# Altium schematic sheet BMS.SchDoc
size A2; SheetNumber: 3; SheetTotal: 10
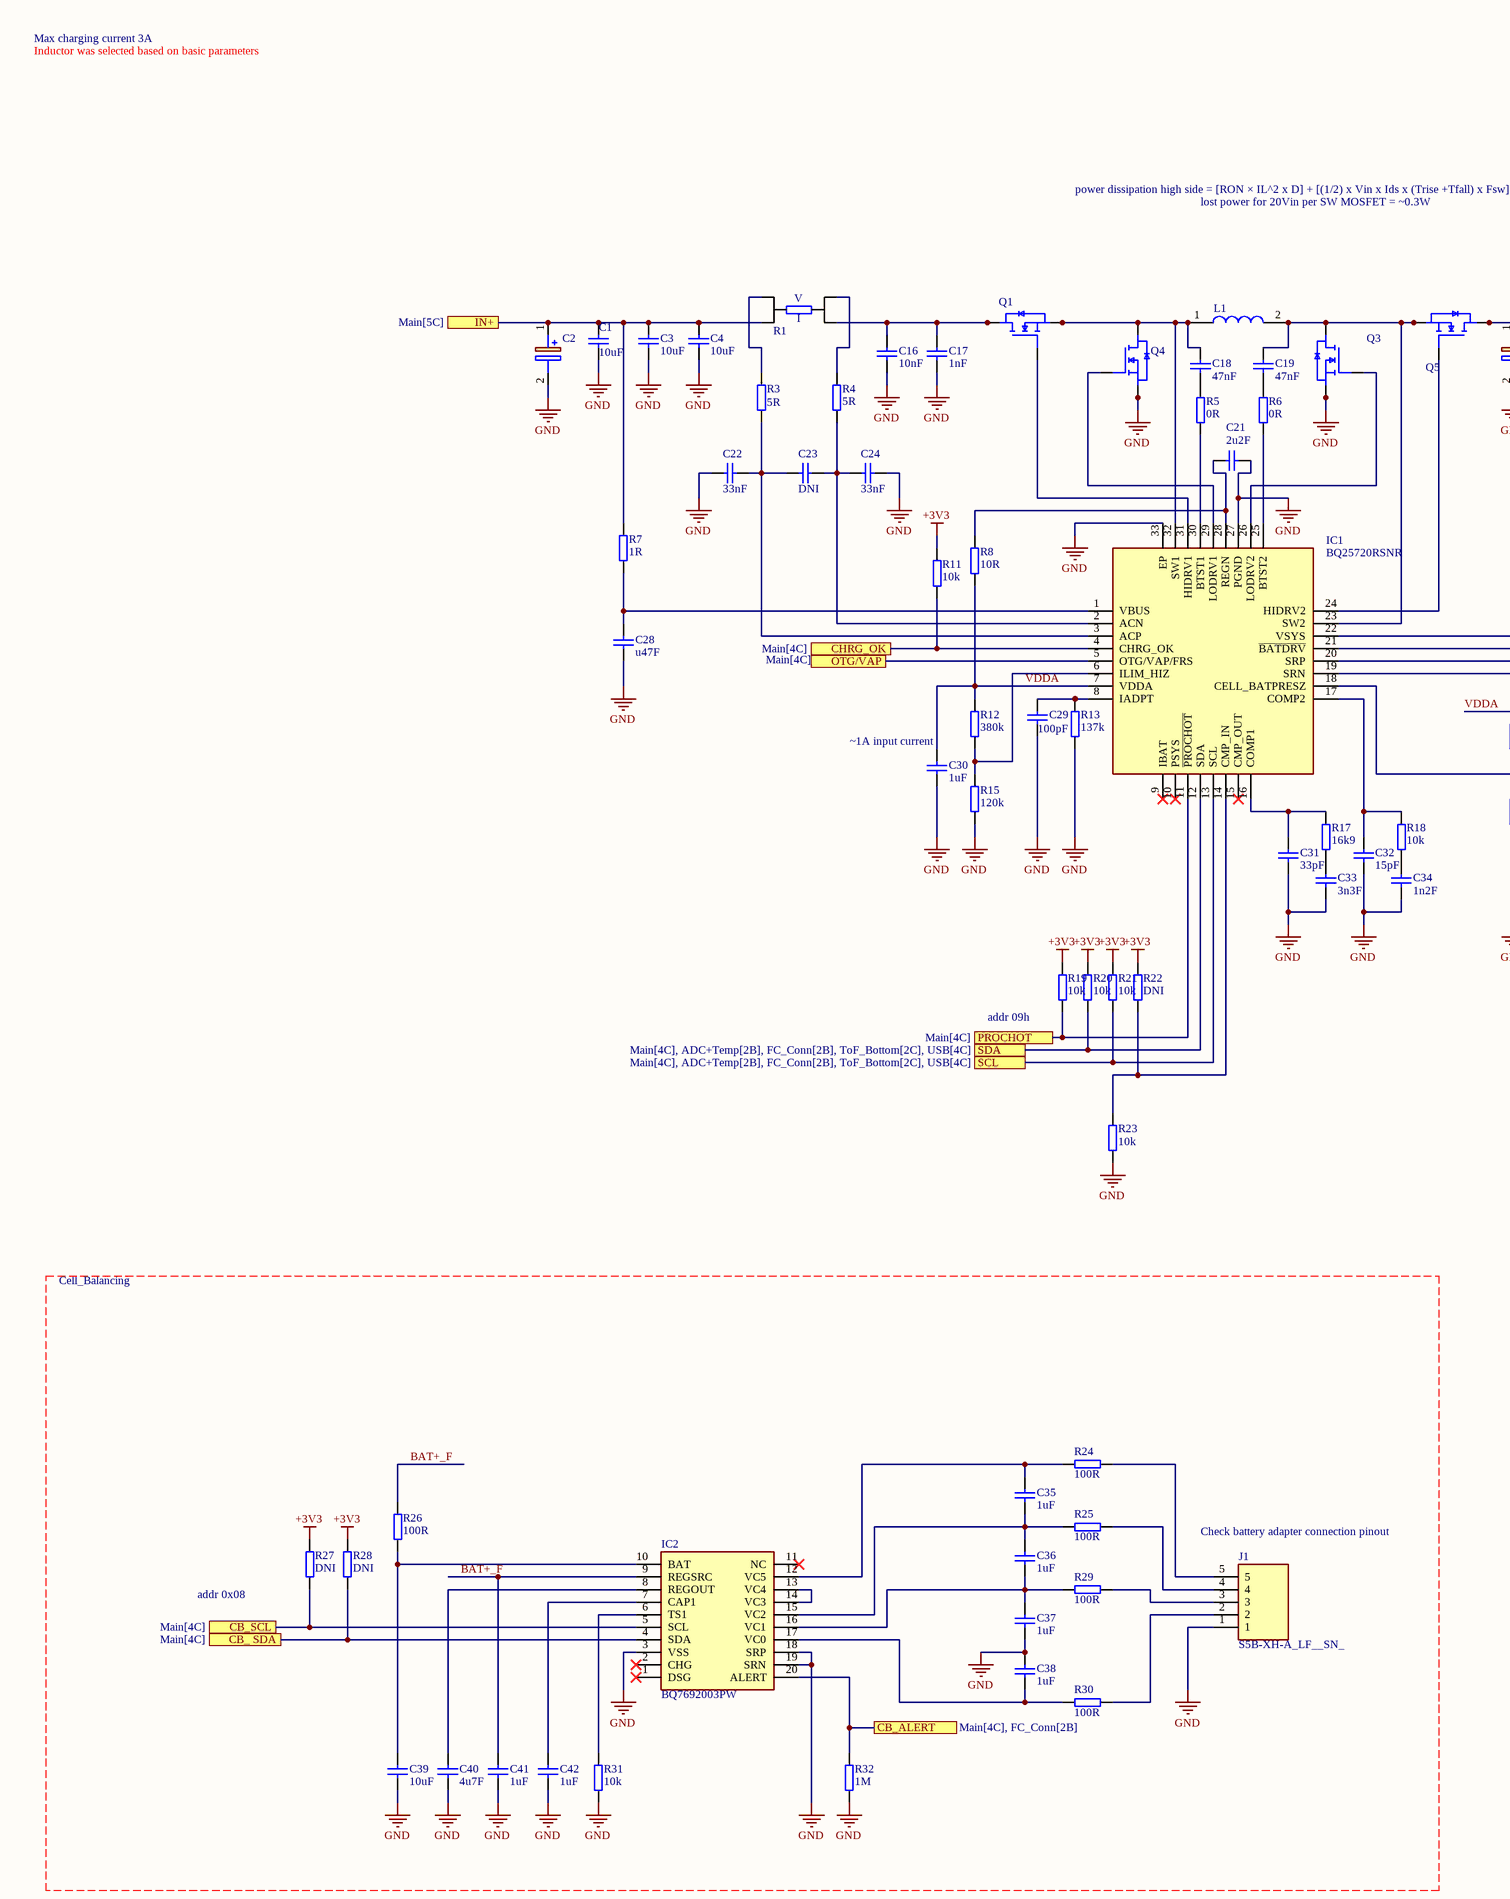
[diagram p0: BMS.SchDoc, left]
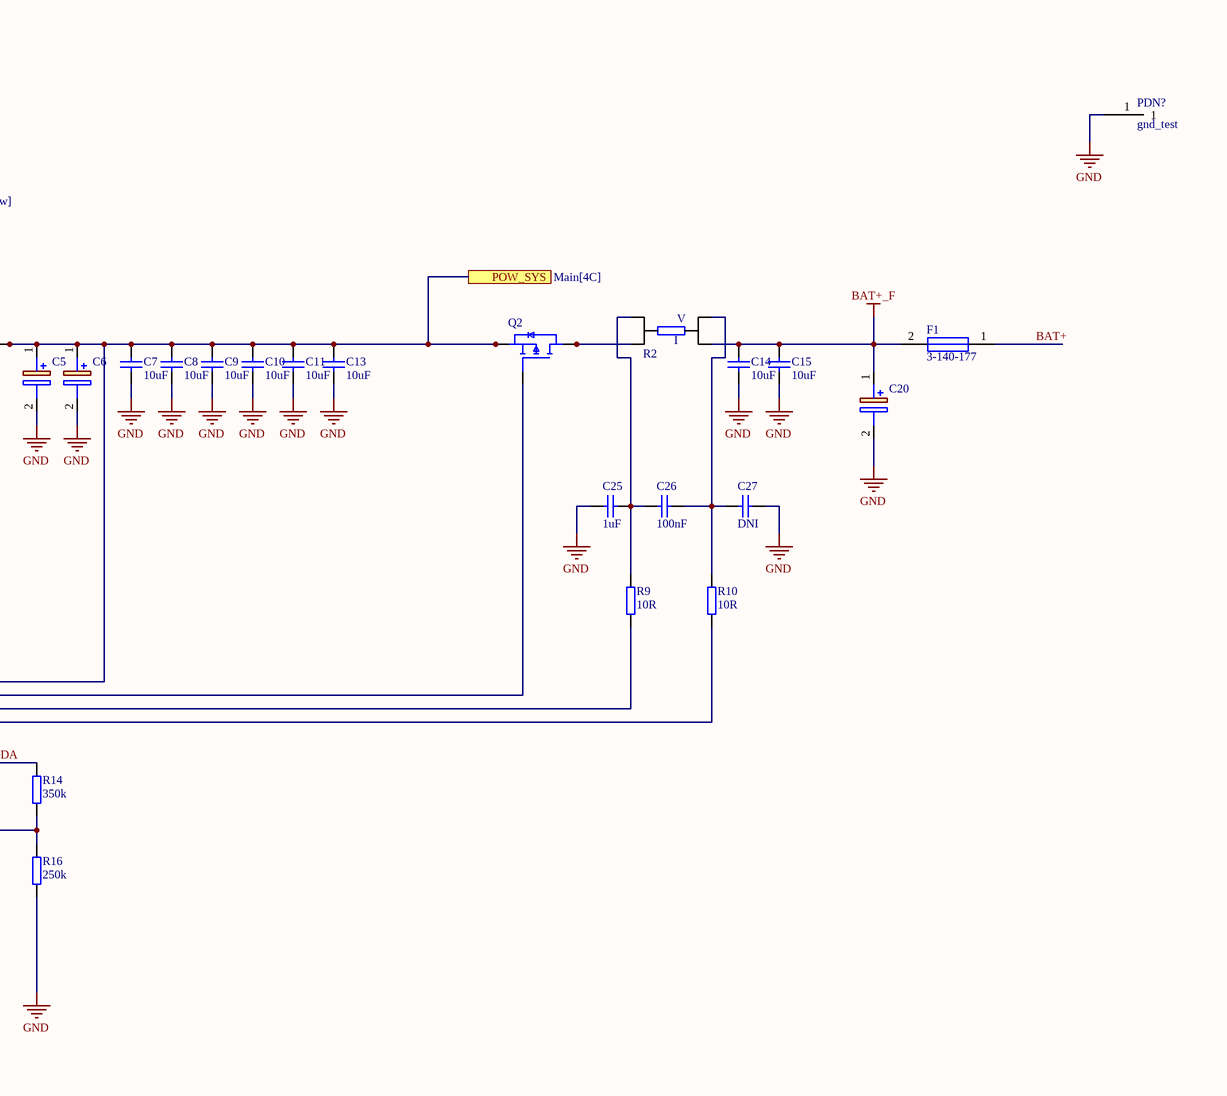
[diagram p1: BMS.SchDoc, right]

## Parts
C1  value 10uF  [CAP0603]  (hidden comment: Cap0603)
C2  TR3D336K025D0200  [CAPPM7343X310N]  (value not drawn)
C3  value 10uF  [CAP0805]  (hidden comment: Cap0805)
C4  value 10uF  [CAP0805]  (hidden comment: Cap0805)
C5  293D226X0025D2TE3  [CAPPM7343X310N]  (value not drawn)
C6  293D226X0025D2TE3  [CAPPM7343X310N]  (value not drawn)
C7  value 10uF  [CAP0805]  (hidden comment: Cap0805)
C8  value 10uF  [CAP0805]  (hidden comment: Cap0805)
C9  value 10uF  [CAP0805]  (hidden comment: Cap0805)
C10  value 10uF  [CAP0805]  (hidden comment: Cap0805)
C11  value 10uF  [CAP0805]  (hidden comment: Cap0805)
C13  value 10uF  [CAP0805]  (hidden comment: Cap0805)
C14  value 10uF  [CAP0805]  (hidden comment: Cap0805)
C15  value 10uF  [CAP0805]  (hidden comment: Cap0805)
C16  value 10nF  [CAP0402]  (hidden comment: Cap0402)
C17  value 1nF  [CAP0402]  (hidden comment: Cap0402)
C18  value 47nF  [CAP0402]  (hidden comment: Cap0402)
C19  value 47nF  [CAP0402]  (hidden comment: Cap0402)
C20  EEH-ZL1V151XP  [EEEHP1H4R7P]  (value not drawn)
C21  value 2u2F  [CAP0402]  (hidden comment: Cap0402)
C22  value 33nF  [CAP0402]  (hidden comment: Cap0402)
C23  value DNI  [CAP0402]  (hidden comment: Cap0402)
C24  value 33nF  [CAP0402]  (hidden comment: Cap0402)
C25  value 1uF  [CAP0402]  (hidden comment: Cap0402)
C26  value 100nF  [CAP0402]  (hidden comment: Cap0402)
C27  value DNI  [CAP0402]  (hidden comment: Cap0402)
C28  value u47F  [CAP0603]  (hidden comment: Cap0603)
C29  value 100pF  [CAP0402]  (hidden comment: Cap0402)
C30  value 1uF  [CAP0402]  (hidden comment: Cap0402)
C31  value 33pF  [CAP0402]  (hidden comment: Cap0402)
C32  value 15pF  [CAP0402]  (hidden comment: Cap0402)
C33  value 3n3F  [CAP0402]  (hidden comment: Cap0402)
C34  value 1n2F  [CAP0402]  (hidden comment: Cap0402)
C35  value 1uF  [CAP0402]  (hidden comment: Cap0402)
C36  value 1uF  [CAP0402]  (hidden comment: Cap0402)
C37  value 1uF  [CAP0402]  (hidden comment: Cap0402)
C38  value 1uF  [CAP0402]  (hidden comment: Cap0402)
C39  value 10uF  [CAP0805]  (hidden comment: Cap0805)
C40  value 4u7F  [CAP0805]  (hidden comment: Cap0402)
C41  value 1uF  [CAP0402]  (hidden comment: Cap0402)
C42  value 1uF  [CAP0402]  (hidden comment: Cap0402)
F1  3-140-177  [3140177]
IC1  BQ25720RSNR  [QFN40P400X400X80-33N-D]
IC2  BQ7692003PW  [SOP65P640X120-20N]
J1  S5B-XH-A_LF__SN_  [SHDRRA5W64P0X250_1X5_1490X1150X610P]
L1  XEL4020-222MEC  [XEL4020222MEC]  (value not drawn)
PDN?  gnd_test  [GND_test]
Q1  PMPB07R3ENAX  [DMT3006LFDF7]  (value not drawn)
Q2  SISA01DN-T1-GE3  [SIS862DNT1GE3]  (value not drawn)
Q3  PMPB07R3ENAX  [DMT3006LFDF7]  (value not drawn)
Q4  PMPB07R3ENAX  [DMT3006LFDF7]  (value not drawn)
Q5  PMPB07R3ENAX  [DMT3006LFDF7]  (value not drawn)
R1  L4CA0612LR010FNR  [L4CA0612L0M50FNR]  (value not drawn)
R2  L4CA0612LR010FNR  [L4CA0612L0M50FNR]  (value not drawn)
R3  value 5R  [RES0402]  (hidden comment: Res0402)
R4  value 5R  [RES0402]  (hidden comment: Res0402)
R5  value 0R  [RES0402]  (hidden comment: Res0402)
R6  value 0R  [RES0402]  (hidden comment: Res0402)
R7  value 1R  [RES0603]  (hidden comment: Res0603)
R8  value 10R  [RES0402]  (hidden comment: Res0402)
R9  value 10R  [RES0402]  (hidden comment: Res0402)
R10  value 10R  [RES0402]  (hidden comment: Res0402)
R11  value 10k  [RES0402]  (hidden comment: Res0402)
R12  value 380k  [RES0402]  (hidden comment: Res0402)
R13  value 137k  [RES0402]  (hidden comment: Res0402)
R14  value 350k  [RES0402]  (hidden comment: Res0402)
R15  value 120k  [RES0402]  (hidden comment: Res0402)
R16  value 250k  [RES0402]  (hidden comment: Res0402)
R17  value 16k9  [RES0402]  (hidden comment: Res0402)
R18  value 10k  [RES0402]  (hidden comment: Res0402)
R19  value 10k  [RES0402]  (hidden comment: Res0402)
R20  value 10k  [RES0402]  (hidden comment: Res0402)
R21  value 10k  [RES0402]  (hidden comment: Res0402)
R22  value DNI  [RES0402]  (hidden comment: Res0402)
R23  value 10k  [RES0402]  (hidden comment: Res0402)
R24  value 100R  [RES0805]  (hidden comment: Res0805)
R25  value 100R  [RES0805]  (hidden comment: Res0805)
R26  value 100R  [RES0402]  (hidden comment: Res0805)
R27  value DNI  [RES0402]  (hidden comment: Res0402)
R28  value DNI  [RES0402]  (hidden comment: Res0402)
R29  value 100R  [RES0805]  (hidden comment: Res0805)
R30  value 100R  [RES0805]  (hidden comment: Res0805)
R31  value 10k  [RES0402]  (hidden comment: Res0402)
R32  value 1M  [RES0402]  (hidden comment: Res0402)

## Ports
CB_ SDA (see Main[4C]), CB_ALERT (see Main[4C], FC_Conn[2B]), CB_SCL (see Main[4C]), CHRG_OK (see Main[4C]), IN+ (see Main[5C]), OTG/VAP (see Main[4C]), POW_SYS (see Main[4C]), PROCHOT (see Main[4C]), SCL (see Main[4C], ADC+Temp[2B], FC_Conn[2B], ToF_Bottom[2C], USB[4C]), SDA (see Main[4C], ADC+Temp[2B], FC_Conn[2B], ToF_Bottom[2C], USB[4C])

## Nets
+3V3: R11.2 R19.2 R20.2 R21.2 R22.2 R27.2 R28.2
BAT+_F: C14.2 C15.2 C20.1(+) C41.2 F1.2 IC2.9(REGSRC) R2.2 R26.2
GND: C1.1 C2.2(-) C3.1 C4.1 C5.2(-) C6.2(-) C7.1 C8.1 C9.1 C10.1 C11.1 C13.1 C14.1 C15.1 C16.1 C17.1 C20.2(-) C21.1 C22.1 C24.2 C25.1 C27.2 C28.1 C29.1 C30.1 C31.1 C32.1 C33.1 C34.1 C37.1 C38.2 C39.1 C40.1 C41.1 C42.1 IC1.27(PGND) IC1.33(EP) IC2.3(VSS) IC2.18(SRP) IC2.19(SRN) J1.1 PDN?.1 Q3.4(S_1) Q3.8(S_2) Q4.4(S_1) Q4.8(S_2) R13.1 R15.1 R16.1 R23.1 R31.1 R32.1
BAT+: F1.1
CB_ SDA: IC2.4(SDA) R28.1 ; port CB_ SDA
CB_ALERT: IC2.20(ALERT) R32.2 ; port CB_ALERT
CB_SCL: IC2.5(SCL) R27.1 ; port CB_SCL
CHRG_OK: IC1.4(CHRG_OK) R11.1 ; port CHRG_OK
IN+: C1.2 C2.1(+) C3.2 C4.2 R1.2 R7.2 ; port IN+
OTG/VAP: IC1.5(OTG/VAP/FRS) ; port OTG/VAP
POW_SYS: C5.1(+) C6.1(+) C7.2 C8.2 C9.2 C10.2 C11.2 C13.2 IC1.22(VSYS) Q2.1(S_1) Q2.2(S_2) Q2.3(S_3) Q5.1(D_1) Q5.2(D_2) Q5.5(D_3) Q5.6(D_4) Q5.7(D_5) ; port POW_SYS
PROCHOT: IC1.11(~{PROCHOT}) R19.1 ; port PROCHOT
SCL: IC1.13(SCL) R21.1 ; port SCL
SDA: IC1.12(SDA) R20.1 ; port SDA
VDDA: C30.2 IC1.7(VDDA) R8.2 R12.2 R14.2
NetC16_2: C16.2 C17.2 Q1.1(D_1) Q1.2(D_2) Q1.5(D_3) Q1.6(D_4) Q1.7(D_5) R1.3
NetC18_1: C18.1 R5.2
NetC18_2: C18.2 IC1.32(SW1) L1.1 Q1.4(S_1) Q1.8(S_2) Q4.1(D_1) Q4.2(D_2) Q4.5(D_3) Q4.6(D_4) Q4.7(D_5)
NetC19_1: C19.1 R6.2
NetC19_2: C19.2 IC1.23(SW2) L1.2 Q3.1(D_1) Q3.2(D_2) Q3.5(D_3) Q3.6(D_4) Q3.7(D_5) Q5.4(S_1) Q5.8(S_2)
NetC21_2: C21.2 IC1.28(REGN) R8.1
NetC22_2: C22.2 C23.1 IC1.3(ACP) R3.1
NetC23_2: C23.2 C24.1 IC1.2(ACN) R4.1
NetC25_2: C25.2 C26.1 R2.4 R9.2
NetC26_2: C26.2 C27.1 R2.1 R10.2
NetC28_2: C28.2 IC1.1(VBUS) R7.1
NetC29_2: C29.2 IC1.8(IADPT) R13.2
NetC31_2: C31.2 IC1.16(COMP1) R17.2
NetC32_2: C32.2 IC1.17(COMP2) R18.2
NetC33_2: C33.2 R17.1
NetC34_2: C34.2 R18.1
NetC35_1: C35.1 C36.2 IC2.15(VC2) R25.1
NetC35_2: C35.2 IC2.12(VC5) R24.1
NetC36_1: C36.1 C37.2 IC2.16(VC1) R29.1
NetC38_1: C38.1 IC2.17(VC0) R30.1
NetC39_2: C39.2 IC2.10(BAT) R26.1
NetC40_2: C40.2 IC2.8(REGOUT)
NetC42_2: C42.2 IC2.7(CAP1)
NetIC1_6: IC1.6(ILIM_HIZ) R12.1 R15.2
NetIC1_14: IC1.14(CMP_IN) R22.1 R23.2
NetIC1_18: IC1.18(CELL_BATPRESZ) R14.1 R16.2
NetIC1_19: IC1.19(SRN) R10.1
NetIC1_20: IC1.20(SRP) R9.1
NetIC1_21: IC1.21(~{BATDRV}) Q2.4(G)
NetIC1_24: IC1.24(HIDRV2) Q5.3(G)
NetIC1_25: IC1.25(BTST2) R6.1
NetIC1_26: IC1.26(LODRV2) Q3.3(G)
NetIC1_29: IC1.29(LODRV1) Q4.3(G)
NetIC1_30: IC1.30(BTST1) R5.1
NetIC1_31: IC1.31(HIDRV1) Q1.3(G)
NetIC2_6: IC2.6(TS1) R31.2
NetIC2_13: IC2.13(VC4) IC2.14(VC3)
NetJ1_2: J1.2 R30.2
NetJ1_3: J1.3 R29.2
NetJ1_4: J1.4 R25.2
NetJ1_5: J1.5 R24.2
NetQ2_5: Q2.5(D_1) Q2.6(D_2) Q2.7(D_3) Q2.8(D_4) Q2.9(D_4) R2.3
NetR1_1: R1.1 R3.2
NetR1_4: R1.4 R4.2

Not connected (* = marked no-connect by the designer): IC1 9(IBAT)* 10(PSYS)* 15(CMP_OUT)*; IC2 1(DSG)* 2(CHG)* 11(NC)*

## Notes on the sheet
- Max charging current 3A
- Inductor was selected based on basic parameters
- power dissipation high side = [RON × IL^2 x D] + [(1/2) x Vin x Ids x (Trise +Tfall) x Fsw]
- lost power for 20Vin per SW MOSFET = ~0.3W
- (near C30) ~1A input current
- (near R19) addr 09h
- Cell_Balancing
- (near J1) Check battery adapter connection pinout
- addr 0x08
- (in symbol L4CA0612LR010FNR) V; I

## Library data of the parts
C1 C28 = Cap0603: Voltage: 25V
C2 = TR3D336K025D0200: Capacitor Polarised; Manufacturer_Name: Vishay; Value: 33uF; Datasheet Link: http://www.vishay.com/doc?40080; Height: 3.1mm; Manufacturer_Part_Number: TR3D336K025D0200; Mouser Part Number: 74-TR3D336K025D0200; Mouser Price/Stock: https://www.mouser.com/Search/Refine.aspx?Keyword=74-TR3D336K025D0200
C3 C4 C7-C11 C13-C15 C39 = Cap0805: Voltage: 50V
C5 C6 = 293D226X0025D2TE3: Capacitor Polarised; Manufacturer_Name: Vishay; Value: 22uF; Datasheet Link: http://www.vishay.com/docs/40002/293d.pdf; Height: 3.1mm; Manufacturer_Part_Number: 293D226X0025D2TE3; Mouser Part Number: 74-293D226X0025D2TE3; Mouser Price/Stock: https://www.mouser.co.uk/ProductDetail/Vishay-Sprague/293D226X0025D2TE3?qs=27QRfRkF2isTHSjSebANCw%3D%3D
C16-C19 C40-C42 = Cap0402: Voltage: 50V
C20 = EEH-ZL1V151XP: Capacitor Polarised; Manufacturer_Name: Panasonic; Datasheet Link: https://industrial.panasonic.com/cdbs/www-data/pdf/RDD0000/ast-ind-303928.pdf; Manufacturer_Part_Number: EEH-ZL1V151XP
C21 C29-C34 = Cap0402: Voltage: 25V
C22 C24-C26 C35-C38 = Cap0402: Voltage: 6V3
F1 = 3-140-177: Fuse; Manufacturer_Name: SCHURTER; Datasheet Link: https://www.schurter.com/en/datasheet/typ_UHS.pdf; Height: 4.85mm; Manufacturer_Part_Number: 3-140-177; Mouser Part Number: 693-3-140-177; Mouser Price/Stock: https://www.mouser.co.uk/ProductDetail/Schurter/3-140-177?qs=3Rah4i%252BhyCHL3c0yS6dOkg%3D%3D; Arrow Part Number: 3-140-177; Arrow Price/Stock: https://www.arrow.com/en/products/3-140-177/schurter?region=europe
IC1 = BQ25720RSNR: Integrated Circuit; Manufacturer_Name: Texas Instruments; Datasheet Link: https://www.ti.com/lit/ds/symlink/bq25720.pdf?ts=1649085131820&ref_url=https%253A%252F%252Fwww.ti.com%252Fproduct%252FBQ25720; Height: 0.8mm; Manufacturer_Part_Number: BQ25720RSNR; Mouser Part Number: 595-BQ25720RSNR; Mouser Price/Stock: https://www.mouser.co.uk/ProductDetail/Texas-Instruments/BQ25720RSNR?qs=ljCeji4nMDlwF8f%2Foae7aQ%3D%3D
IC2 = BQ7692003PW: Integrated Circuit; Manufacturer_Name: Texas Instruments; Datasheet Link: http://www.ti.com/lit/gpn/BQ76920; Height: 1.2mm; Manufacturer_Part_Number: BQ7692003PW; Mouser Part Number: 595-BQ7692003PW; Mouser Price/Stock: https://www.mouser.co.uk/ProductDetail/Texas-Instruments/BQ7692003PW?qs=%2Fd%252BFzHvH4c0Hx6X3GvdboA%3D%3D; Arrow Part Number: BQ7692003PW; Arrow Price/Stock: https://www.arrow.com/en/products/bq7692003pw/texas-instruments?utm_currency=USD&region=nac
J1 = S5B-XH-A_LF__SN_: Connector; Manufacturer_Name: JST (JAPAN SOLDERLESS TERMINALS); Manufacturer_Part_Number: S5B-XH-A(LF)(SN); Datasheet Link: http://www.jst-mfg.com/product/pdf/eng/eXH.pdf; Height: 6.1mm; Mouser Part Number: 306-S5B-XH-ALFSN; Mouser Price/Stock: https://www.mouser.co.uk/ProductDetail/JST-Commercial/S5B-XH-ALFSN?qs=QpmGXVUTftFJm7Okp%252B2lFg%3D%3D; Arrow Part Number: S5B-XH-A(LF)(SN); Arrow Price/Stock: https://www.arrow.com/en/products/s5b-xh-a-lf-sn/jst-manufacturing?utm_currency=USD&region=europe
L1 = XEL4020-222MEC: Inductor; Manufacturer_Name: COILCRAFT; Height: 2.1mm; Manufacturer_Part_Number: XEL4020-222MEC; Mouser Part Number: 994-XEL4020-222MEC; Mouser Price/Stock: https://www.mouser.co.uk/ProductDetail/Coilcraft/XEL4020-222MEC?qs=chTDxNqvsynf4rqMeCpizg%3D%3D
Q1 Q3-Q5 = DMT3006LFDF-7: MOSFET (N-Channel); Manufacturer_Name: Diodes Incorporated; Datasheet Link: https://www.arrow.com/en/products/dmt3006lfdf-7/diodes-incorporated; Height: 0.63mm; Manufacturer_Part_Number: DMT3006LFDF-7; Mouser Part Number: 621-DMT3006LFDF-7; Mouser Price/Stock: https://www.mouser.co.uk/ProductDetail/Diodes-Incorporated/DMT3006LFDF-7?qs=4EhzHfbM1GhGS5nn3gf3wg%3D%3D; Arrow Part Number: DMT3006LFDF-7; Arrow Price/Stock: https://www.arrow.com/en/products/dmt3006lfdf-7/diodes-incorporated
Q2 = SISA01DN-T1-GE3: MOSFET (P-Channel); Manufacturer_Name: Vishay; Datasheet Link: https://www.vishay.com/docs/76198/sisa01dn.pdf; Manufacturer_Part_Number: SISA01DN-T1-GE3; Mouser Part Number: 78-SISA01DN-T1-GE3; Mouser Price/Stock: https://www.mouser.co.uk/ProductDetail/Vishay-Semiconductors/SISA01DN-T1-GE3?qs=chTDxNqvsymq6IcOj9ze4g%3D%3D; Arrow Part Number: SISA01DN-T1-GE3; Arrow Price/Stock: https://www.arrow.com/en/products/sisa01dn-t1-ge3/vishay?region=nac
R1 R2 = L4CA0612LR010FNR: Resistor; Manufacturer_Name: LITTELFUSE; Datasheet Link: https://www.littelfuse.com/media?resourcetype=datasheets&itemid=db674d7b-aa25-4173-816a-92297475a59f&filename=littelfuse-resistor-l4ca-c-datasheet; Height: 0.7mm; Manufacturer_Part_Number: L4CA0612LR010FNR
C23 C27 = Cap0402: Voltage: DNI